# EAGLE design interface boardjbjkb (EAGLE 7.6.0)
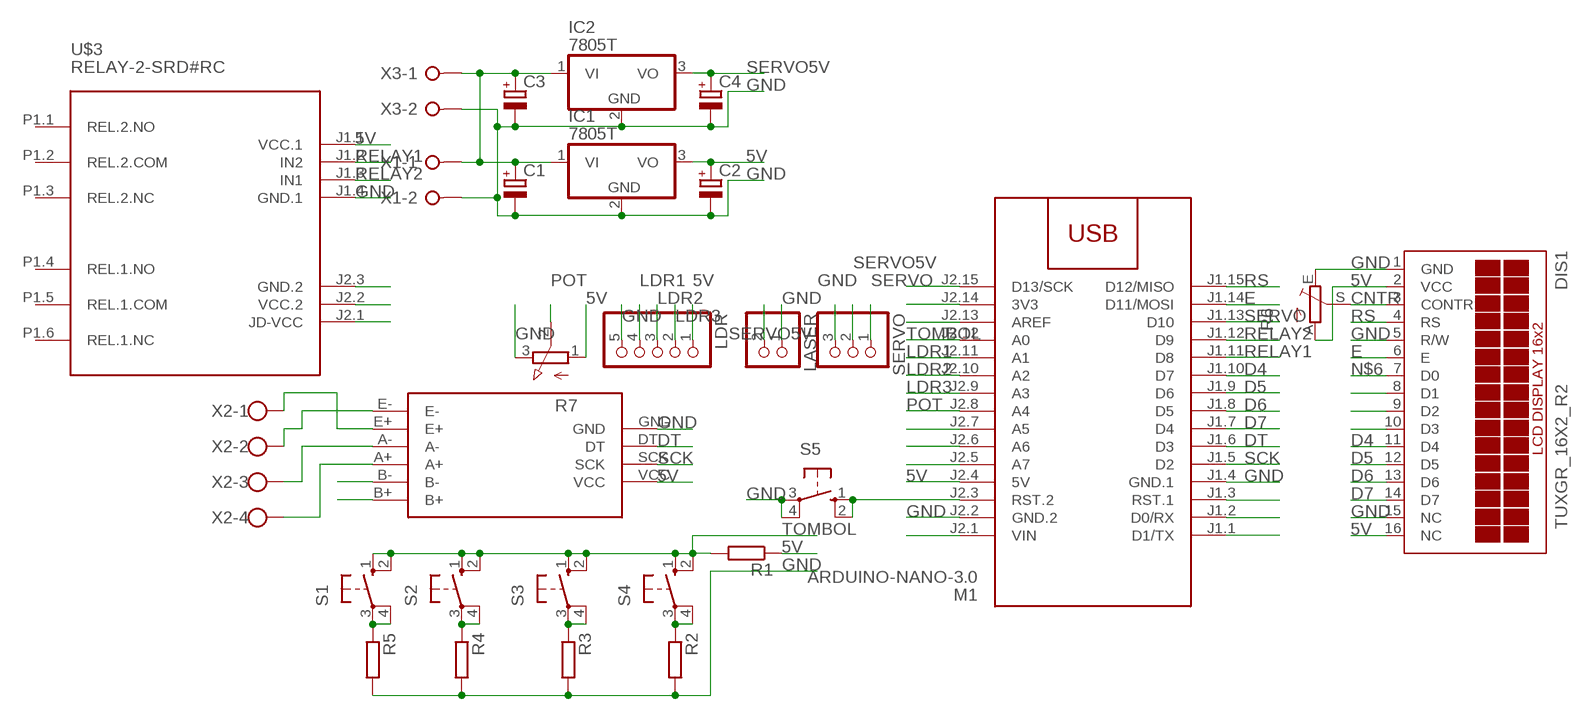
[diagram p0: schematic, sheet 1]

## Parts
C1  CPOL-EUE2.5-7  [E2,5-7]
C2  CPOL-EUE2.5-7  [E2,5-7]
C3  CPOL-EUE2.5-7  [E2,5-7]
C4  CPOL-EUE2.5-7  [E2,5-7]
DIS1  TUXGR_16X2_R2  [TUXGR_16X2_R2]
IC1  7805T  [TO220H]
IC2  7805T  [TO220H]
LASER  PINHD-1X2  [1X02]
LDR  PINHD-1X5  [1X05]
M1  ARDUINO-NANO-3.0  [ARDUINO-NANO-3.0]
R1  R-EU_0207/10  [0207/10]
R2  R-EU_0207/10  [0207/10]
R3  R-EU_0207/10  [0207/10]
R4  R-EU_0207/10  [0207/10]
R5  R-EU_0207/10  [0207/10]
R6  TRIM_EU-B25P  [B25P]
R7  3RP/1610N  [3RP/1610N]
S1  40-XX  [B3F-40XX]
S2  40-XX  [B3F-40XX]
S3  40-XX  [B3F-40XX]
S4  40-XX  [B3F-40XX]
S5  10-XX  [B3F-10XX]
SERVO  PINHD-1X3  [1X03]
U$2  HX711  [HX711]
U$3  RELAY-2-SRD#RC  [RELAY-2-SRD#RC]
X1  W237-02P  [W237-132]
X2  W237-4  [W237-4]
X3  W237-02P  [W237-132]

## Nets
5V: C2.+ DIS1.2(VCC) DIS1.16(NC) IC1.3(VO) LDR.1 M1.J2.4(5V) R1.1 R6.A R7.1(A) U$2.VCC U$3.J1.1(VCC.1)
CNTR: DIS1.3(CONTR) R6.S
D4: DIS1.11(D4) M1.J1.10(D7)
D5: DIS1.12(D5) M1.J1.9(D6)
D6: DIS1.13(D6) M1.J1.8(D5)
D7: DIS1.14(D7) M1.J1.7(D4)
DT: M1.J1.6(D3) U$2.DT
E: DIS1.6(E) M1.J1.14(D11/MOSI)
GND: C1.- C2.- C3.- C4.- DIS1.1(GND) DIS1.5(R/W) DIS1.15(NC) IC1.2(GND) IC2.2(GND) LASER.1 LDR.5 M1.J1.4(GND.1) M1.J2.2(GND.2) R2.2 R3.2 R4.2 R5.2 R6.E R7.3(E) S5.3(P) S5.4(P1) SERVO.3 U$2.GND U$3.J1.4(GND.1) X1.2 X3.2
LDR1: LDR.4 M1.J2.11(A1)
LDR2: LDR.3 M1.J2.10(A2)
LDR3: LDR.2 M1.J2.9(A3)
N$1: C1.+ C3.+ IC1.1(VI) IC2.1(VI) X1.1 X3.1
N$2: U$2.E- X2.2
N$3: U$2.E+ X2.1
N$6: DIS1.7(D0)
N$7: DIS1.8(D1)
N$8: DIS1.9(D2)
N$9: DIS1.10(D3)
N$17: R2.1 S4.3(P) S4.4(P1)
N$18: R3.1 S3.3(P) S3.4(P1)
N$19: R4.1 S2.3(P) S2.4(P1)
N$20: R5.1 S1.3(P) S1.4(P1)
N$22: M1.J2.15(D13/SCK)
N$43: U$2.A- X2.3
N$44: U$2.A+ X2.4
N$45: U$2.B-
N$46: U$2.B+
N$51: M1.J2.14(3V3)
N$52: M1.J2.13(AREF)
N$58: M1.J2.7(A5)
N$59: M1.J2.6(A6)
N$60: M1.J2.5(A7)
N$62: M1.J2.3(RST.2) S5.1(S) S5.2(S1)
N$63: M1.J2.1(VIN)
N$64: M1.J1.1(D1/TX)
N$65: M1.J1.2(D0/RX)
N$66: M1.J1.3(RST.1)
N$78: U$3.J2.2(VCC.2)
N$83: U$3.J2.3(GND.2)
N$84: U$3.J2.1(JD-VCC)
POT: M1.J2.8(A4) R7.2(S)
RELAY1: M1.J1.11(D8) U$3.J1.2(IN2)
RELAY2: M1.J1.12(D9) U$3.J1.3(IN1)
RS: DIS1.4(RS) M1.J1.15(D12/MISO)
SCK: M1.J1.5(D2) U$2.SCK
SERVO: M1.J1.13(D10) SERVO.1
SERVO5V: C4.+ IC2.3(VO) LASER.2 SERVO.2
TOMBOL: M1.J2.12(A0) R1.2 S1.1(S) S1.2(S1) S2.1(S) S2.2(S1) S3.1(S) S3.2(S1) S4.1(S) S4.2(S1)
Unconnected: U$3.P1.1(REL.2.NO) U$3.P1.2(REL.2.COM) U$3.P1.3(REL.2.NC) U$3.P1.4(REL.1.NO) U$3.P1.5(REL.1.COM) U$3.P1.6(REL.1.NC)

## Library data of the parts
C1-C4 = rcl:CPOL-EU: POLARIZED CAPACITOR, European symbol
DIS1 = display-lcd:TUXGR_16X2_R2: Tuxgraphics LCD display 16x2 characters reflective, without background light Source: tuxgr_12x2_r2.pdf; OC_FARNELL: unknown; OC_NEWARK: unknown
IC1 IC2 = linear:78*: Positive VOLTAGE REGULATOR Source: http://cache.national.com/ds/LM/LM78L05.pdf http://www.fairchildsemi.com/ds/LM/LM7805.pdf
LASER = pinhead:PINHD-1X2: PIN HEADER
LDR = pinhead:PINHD-1X5: PIN HEADER
M1 = diy-modules:ARDUINO-NANO-3.0: Arduino Nano 3.0 and compatible devices More details available here: https://www.arduino.cc/en/Main/ArduinoBoardNano Click here to find device on ebay.com <http://www.ebay.com/sch/arduino+nano>
R1-R5 = rcl:R-EU_: RESISTOR, European symbol
R6 = pot:TRIM_EU-: POTENTIOMETER
R7 = pot:3RP/1610N: 16mm Potentiometer one level Source: http://www.alphapotentiometers.net/html/16mm_pot_2.html
S1-S4 = switch-omron:40-XX: OMRON SWITCH; MF: OMRON COMPONENTS USA; MPN: B3F-4000; OC_FARNELL: 176434; OC_NEWARK: 36K3105
S5 = switch-omron:10-XX: OMRON SWITCH; MPN: B3F-1000; OC_FARNELL: 176432; OC_NEWARK: 36M3542
SERVO = pinhead:PINHD-1X3: PIN HEADER
U$2 = HX711:HX711
U$3 = diy-modules:RELAY-2-SRD#RC: 2-Channel Relay Module based on SRD-05VDC-SL-C relays Symbol with relays pins Click here to find device on ebay.com <http://www.ebay.com/sch/two+channel+relay+module+optocoupler+5v>
X1 X3 = con-wago-508:W237-02P: WAGO SREW CLAMP; OC_FARNELL: unknown; OC_NEWARK: unknown
X2 = con-wago-500:W237-4: WAGO SCREW CLAMP; OC_FARNELL: unknown; OC_NEWARK: unknown

## Board
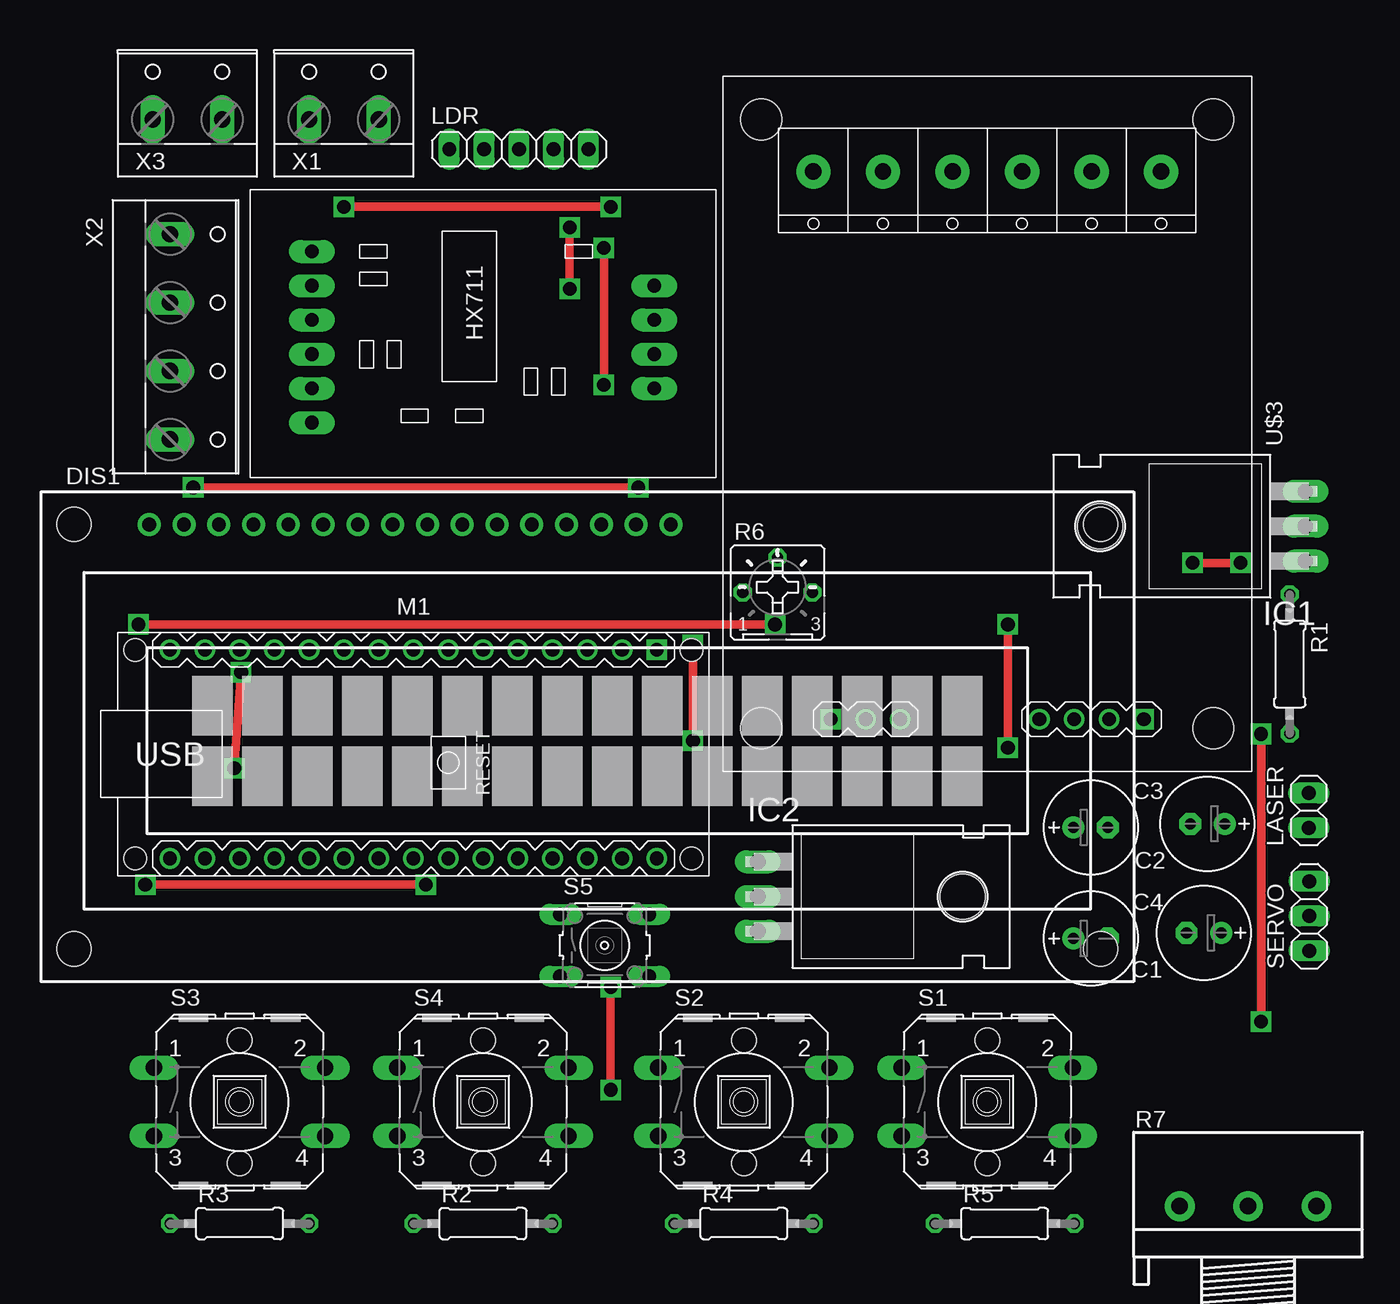
[diagram p1: board, top side]
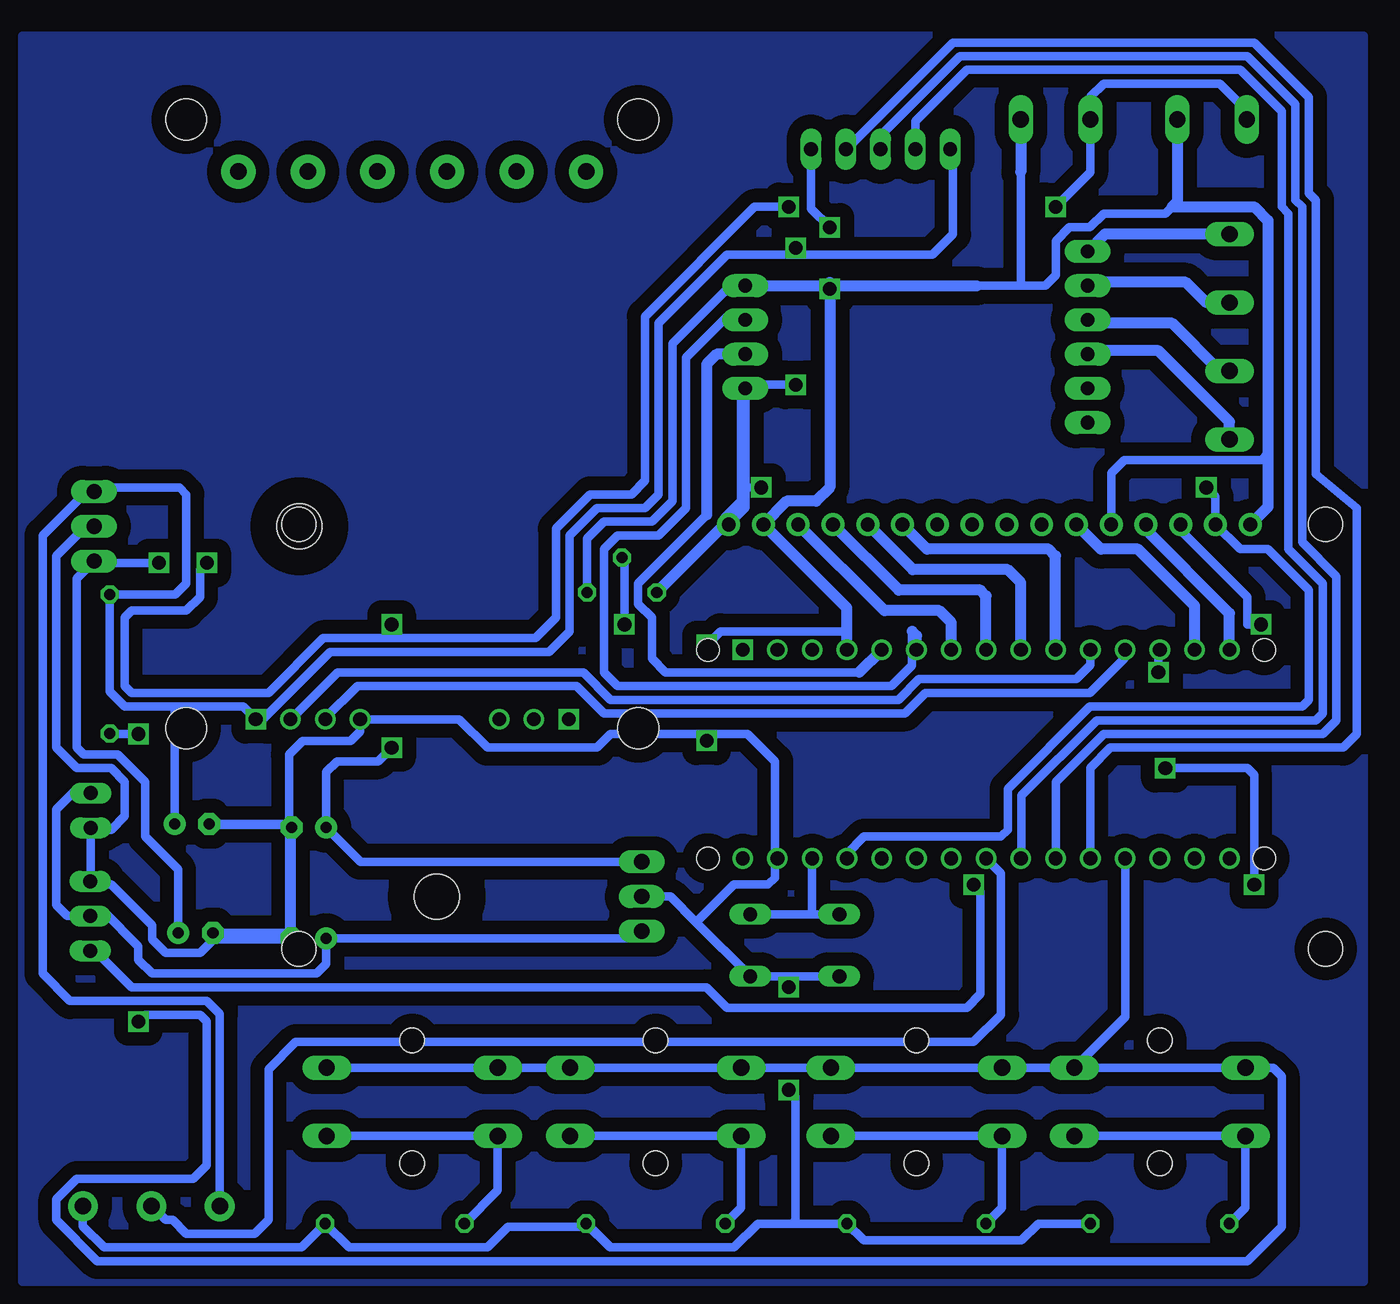
[diagram p2: board, bottom side, seen from below]

No outline drawn. Coordinates in mm, seen from the top.
Copper layers (1*16): Top 0.035mm / dielectric 1.5mm / Bottom 0.035mm
Design rules "default": minimum track width 10mil, minimum drill 24mil, track to track 8mil, track to pad 8mil, pad to pad 8mil, via to via 8mil, smd to smd 8mil, copper to edge 40mil, drill to drill 8mil, minimum pad ring 10mil, minimum via ring 8mil, stop-mask expansion 4mil, vias tented up to drill 0mil, thermal gap 10mil

### Footprints (pad centres in the part's own frame; a part is rotated, then mirrored left to right if it is on the bottom)
E2,5-7 = drill 0.813 pad 1.6: + -1.27,0 | drill 0.813 pad 1.6 octagon: - 1.27,0
TUXGR_16X2_R2 = drill 1 pad 1.676: 1 -32,15.5; 2 -29.46,15.5; 3 -26.92,15.5; 4 -24.38,15.5; 5 -21.84,15.5; 6 -19.3,15.5; 7 -16.76,15.5; 8 -14.22,15.5; 9 -11.68,15.5; 10 -9.14,15.5; 11 -6.6,15.5; 12 -4.06,15.5; 13 -1.52,15.5; 14 1.02,15.5; 15 3.56,15.5; 16 6.1,15.5 | hole 2.5: -37.5,-15.5; 37.5,-15.5; -37.5,15.5; 37.5,15.5
TO220H = drill 1.118 long: 1 -2.54,-10.16; 2 0,-10.16; 3 2.54,-10.16 | hole 3.302: 0,4.826
1X02 = drill 1.016 long: 1 -1.27,0; 2 1.27,0
1X05 = drill 1.016 long: 1 -5.08,0; 2 -2.54,0; 3 0,0; 4 2.54,0; 5 5.08,0
ARDUINO-NANO-3.0 = drill 1 square: J1.1 17.78,7.62 | drill 1: J1.2 15.24,7.62; J1.3 12.7,7.62; J1.4 10.16,7.62; J1.5 7.62,7.62; J1.6 5.08,7.62; J1.7 2.54,7.62; J1.8 0,7.62; J1.9 -2.54,7.62; J1.10 -5.08,7.62; J1.11 -7.62,7.62; J1.12 -10.16,7.62; J1.13 -12.7,7.62; J1.14 -15.24,7.62; J1.15 -17.78,7.62; J2.1 17.78,-7.62; J2.2 15.24,-7.62; J2.3 12.7,-7.62; J2.4 10.16,-7.62; J2.5 7.62,-7.62; J2.6 5.08,-7.62; J2.7 2.54,-7.62; J2.8 0,-7.62; J2.9 -2.54,-7.62; J2.10 -5.08,-7.62; J2.11 -7.62,-7.62; J2.12 -10.16,-7.62; J2.13 -12.7,-7.62; J2.14 -15.24,-7.62; J2.15 -17.78,-7.62 | hole 1.651: -20.32,7.62; -20.32,-7.62; 20.32,-7.62; 20.32,7.62
0207/10 = drill 0.813 octagon: 1 -5.08,0; 2 5.08,0
B25P = drill 0.813 octagon: A -2.54,0; E 2.54,0; S 0,2.54
3RP/1610N = drill 1.2 pad 2.184: 1 -5,0; 2 0,0; 3 5,0
B3F-40XX = drill 1.194 long: 1 -6.248,2.489; 2 6.248,2.489; 3 -6.248,-2.489; 4 6.248,-2.489 | hole 1.803: 0,-4.496; 0,4.496
B3F-10XX = drill 1.016 long: 1 -3.251,2.261; 2 3.251,2.261; 3 -3.251,-2.261; 4 3.251,-2.261
1X03 = drill 1.016 long: 1 -2.54,0; 2 0,0; 3 2.54,0
HX711 = drill 1 pad 1.676 long: A+ -12.5,0; A- -12.5,2.5; B+ -12.5,-5; B- -12.5,-2.5; DT 12.5,2.5; E+ -12.5,7.5; E- -12.5,5; GND 12.5,5; SCK 12.5,0; VCC 12.5,-2.5
RELAY-2-SRD#RC = drill 1 square: J1.1 21.59,11.43; J2.1 21.59,-11.43 | drill 1: J1.2 21.59,8.89; J1.3 21.59,6.35; J1.4 21.59,3.81; J2.2 21.59,-8.89; J2.3 21.59,-6.35 | drill 1.2 pad 2.5: P1.1 -18.415,12.7; P1.2 -18.415,7.62; P1.3 -18.415,2.54; P1.4 -18.415,-2.54; P1.5 -18.415,-7.62; P1.6 -18.415,-12.7 | hole 3: -22.225,16.51; 22.225,16.51; 22.225,-16.51; -22.225,-16.51
W237-132 = drill 1.194 long: 1 -2.54,-0.635; 2 2.54,-0.635
W237-4 = drill 1.194 long: 1 -7.5,-1.27; 2 -2.5,-1.27; 3 2.5,-1.27; 4 7.5,-1.27

### Placement (x,y rotation side)
C1  79.33,36.48 180 top
C2  79.59,44.44 180 top
C3  71.05,44.18 0 top
C4  71.05,36.06 0 top
DIS1  34.29,50.8 0 top
IC1  76.57,66.17 90 top
IC2  56.89,39.13 270 top
LASER  86.98,45.42 90 top
LDR  29.29,93.71 0 top
M1  21.59,49.53 0 top
R1  85.59,56.11 270 top
R2  26.67,15.24 0 top
R3  8.89,15.24 0 top
R4  45.72,15.24 0 top
R5  64.77,15.24 0 top
R6  48.18,61.34 0 top
R7  82.55,16.51 0 top
S1  63.5,24.13 0 top
S2  45.72,24.13 0 top
S3  8.89,24.13 0 top
S4  26.67,24.13 0 top
S5  35.56,35.56 0 top
SERVO  87.02,37.7 90 top
U$2  26.67,78.74 0 top
U$3  63.5,73.66 270 top
X1  16.51,96.52 0 top
X2  5.08,80.01 270 top
X3  5.08,96.52 0 top

### Tracks (layer width: path | path; a pad name or v marks a point on that pad's centre or on a via)
5V  (via drill 1 pad 1.27)
  Top 0.61: v5.5,69 v38,69 | v35.5,76.5 v35.5,86.5
  Bottom 0.61: U$2.VCC 39.17,69 | 39.17,69 39.17,67.52 DIS1.16 | 81,53 84.5,53 85.59,54.09 R1.1 80.81,61.19 80,62 80,68.5 80.5,69 86.44,69 IC1.3 | 81,53 75.86,53 U$3.J1.1 74.43,52.07 69.5,57 53.5,57 52,58.5 52,65.5 50,67.5 46.5,67.5 45.5,68.5 45.5,81 40.5,86 35,86 | C2.+ 80.86,52.86 81,53 | 85.5,68.5 86.52,68.5 IC1.3 | R7.1 77.55,30.55 78.5,31.5 88.5,31.5 90.5,33.5 90.5,65.5 87.5,68.5 86.94,68.5 IC1.3 | v5.5,69 4.83,68.33 DIS1.2 3.03,64.5 1,64.5 -2,61.5 -2,53.5 -1.5,53 14,53 20,47 20,44 20.5,43.5 30.5,43.5 31.75,42.25 M1.J2.4 | v38,69 39.17,69 | 35,86 25.5,86 24,87.5 24,93.5 LDR.1 | 40.68,66.3 40.68,66.82 39.5,68 39.5,76 39,76.5 v35.5,76.5 | v35.5,86.5 35,86
  Bottom 0.813: DIS1.16 40.68,66.3 R6.A
CNTR  (via drill 1 pad 1.27)
  Top 0.61: v1.5,59 v48,59
  Bottom 0.61: DIS1.3 7.37,65.87 2.5,61 2.5,59 v1.5,59 | v48,59 48,63.7 R6.S
D4
  Bottom 0.813: M1.J1.10 16.51,64.01 17,64.5 25.89,64.5 DIS1.11
D5
  Bottom 0.813: M1.J1.9 19.05,62.05 20,63 26.93,63 DIS1.12
D6
  Bottom 0.813: M1.J1.8 21.59,61.09 22,61.5 27.97,61.5 DIS1.13
D7
  Bottom 0.813: M1.J1.7 24.13,59.13 25,60 29.01,60 DIS1.14
DT
  Bottom 0.61: 27,58.5 27,56 28.5,54.5 48.5,54.5 49.5,55.5 49.5,64.5 48.5,65.5 45.5,65.5 43.5,67.5 43.5,78.5 40.5,81.5 39.43,81.5 U$2.DT
  Bottom 0.813: M1.J1.6 26.67,58.17 27,58.5
E
  Bottom 0.813: M1.J1.14 6.35,60.35 10.5,64.5 13.19,64.5 DIS1.6
GND  (via drill 1 pad 1.27)
  Top 0.61: v42,50.5 v42,57.5 | v33,88 v33,83.5 | v36,25 v36,32.5
  Bottom 0.61: S5.3 36,33.3 | 36,33.3 S5.4 42.76,37.24 | R3.2 17.76,15.24 19,14 30.51,14 R2.2 35.76,15.24 | 49,13.5 49.06,13.5 R4.2 | R7.3 87.55,15.05 86,13.5 71.59,13.5 R5.2 68.11,13.5 58,13.5 56.5,15 50.5,15 49,13.5 | 49,13.5 40,13.5 38.26,15.24 35.76,15.24 | IC2.2 44.64,39.13 42.76,37.24 | 41.5,51 49,51 50,50 58,50 60.07,52.07 U$3.J1.4 67.31,51.19 68,50.5 71.5,50.5 72.5,49.5 72.5,44.5 | 37,42.08 37,49 39,51 41.5,51 | 37,42.08 M1.J2.2 | 37,42.08 37,40.5 37.5,40 40,40 42.76,37.24 | 72.5,44.5 72.5,44.36 | 72.5,44.36 C3.- C4.- 72.74,36.48 C1.- | 72.5,44.36 78.24,44.36 C2.- 72.56,44.44 72.5,44.5 | 72.5,44.36 72.5,36 78,36 79,35 81.5,35 82.5,36 82.5,37 85.5,40 86.78,40 SERVO.3 86.98,40.28 LASER.1 86.83,44 85.5,44 84.5,45 84.5,47.5 85.5,48.5 88,48.5 89.5,50 89.5,64 87.33,66.17 IC1.2 | 41.5,51 v42,50.5 | v42,57.5 41,58.5 31.75,58.5 | R6.E 50.72,65.28 49.5,66.5 46,66.5 44.5,68 44.5,79.5 40,84 39.43,84 U$2.GND | DIS1.5 12.45,70.05 11.5,71 1.5,71 1,71.5 | LDR.5 34.37,89.37 v33,88 | v33,83.5 33,84 | 8,89.5 8.5,89 13,89 14,88 15.5,88 16.5,87 16.5,84.5 17.26,83.74 19,83.74 | 22.26,83.74 19,83.74 | 19.05,92.05 19.05,83.79 19,83.74 | 35.76,15.24 35.5,15.5 35.5,24.5 v36,25 | v36,32.5 36,33.3
  Bottom 0.813: 22.26,83.74 U$2.GND 33.26,83.74 33,84 33,69 34,68 36.15,68 DIS1.15 31.75,60.2 31.75,58.5 M1.J1.4 | DIS1.1 1,67.59 1,71.5 1,88.5 2,89.5 8,89.5 7.62,89.88 X3.2 | X1.2 19.05,92.05
LDR1
  Bottom 0.61: LDR.4 31.79,93.71 24,101.5 2,101.5 -2,97.5 -2,90.5 -2.5,90 -2.5,70 -5.5,67.5 -5.5,51 -4.5,50 12.5,50 13.97,48.53 M1.J2.11
LDR2
  Bottom 0.61: LDR.3 29,94 29,95 23.5,100.5 2.5,100.5 -1,97 -1,90 -1.5,89.5 -1.5,65 -4,62.5 -4,52 -3,51 13,51 16.5,47.5 M1.J2.10
LDR3
  Bottom 0.61: LDR.2 26.75,95.75 23,99.5 3,99.5 0,96.5 0,89.5 -0.5,89 -0.5,64.5 -3,62 -3,52.5 -2.5,52 13.5,52 19,46.5 19,41.96 M1.J2.9
N$1  (via drill 1 pad 1.27)
  Top 0.61: v16.5,89.5 v36,89.5 | v78.5,63.5 v82,63.5 | v65,50 v65,59
  Bottom 0.61: IC2.1 67.27,41.67 C3.+ 69.78,48.22 69,49 66,49 v65,50 | C1.+ 80.6,41.1 83,43.5 83,47.5 85,49.5 87.5,49.5 88,50 88,62.36 IC1.1 86.6,63.5 v82,63.5 | v16.5,89.5 13.97,92.03 X1.1 13.97,97.53 13,98.5 4.5,98.5 3,97 3,96 2.5,95.5 2.5,95.84 X3.1 | v36,89.5 38.5,89.5 46.5,81.5 46.5,69.5 47.5,68.5 50.5,68.5 53,66 53,59.5 54.5,58 64.5,58 | 64.5,58 70,58 74,54 84,54 84.5,54.5 84.5,59.5 84,60 80,60 79,61 79,63 v78.5,63.5 | v65,59 65,58.5 64.5,58
N$2
  Bottom 0.813: X2.2 5.51,82.51 7,84 13.91,84 U$2.E-
N$3
  Bottom 0.813: X2.1 12.9,87.51 U$2.E+
N$4
  pour Bottom (isolate 1.016): -6,102 92,102 92,11 -6,11
N$17
  Bottom 0.61: R2.1 20.42,16.41 S4.3 S4.4
N$18
  Bottom 0.61: R3.1 2.64,16.41 S3.3 S3.4
N$19
  Bottom 0.61: R4.1 39.47,16.41 S2.3 S2.4 | S2.4 52.36,21.64 52.5,21.5 52.11,21.5 S2.4
N$20
  Bottom 0.61: R5.1 57.25,17.68 S1.3 S1.4
N$43
  Bottom 0.813: X2.3 4.51,77.51 8,81 13.93,81 U$2.A-
N$44
  Bottom 0.813: X2.4 3.81,73.81 9,79 13.91,79 U$2.A+
N$62
  Bottom 0.61: S5.2 34.5,37.82 | 34.5,37.82 S5.1 | M1.J2.3 34.29,38.03 34.5,37.82
POT
  Bottom 0.61: R7.2 82.51,16.51 81.5,15.5 81,15.5 80,14.5 75,14.5 74,15.5 74,26.5 72,28.5 22.5,28.5 20.5,30.5 20.5,40.82 M1.J2.8
RELAY1
  Bottom 0.61: M1.J1.11 13.97,56.03 15,55 26.5,55 28,53.5 49,53.5 51,55.5 68.96,55.5 U$3.J1.2
RELAY2
  Bottom 0.61: U$3.J1.3 69.85,52.15 67.5,54.5 51.5,54.5 49.5,52.5 27.5,52.5 26,54 14,54 11.5,56.5 11.5,57.08 M1.J1.12
RS
  Bottom 0.813: M1.J1.15 3.81,59.81 10,66 10,66.21 DIS1.4
SCK
  Bottom 0.61: 30.86,55.5 45,55.5 46,56.5 46,59.5 47,60.5 47,62 42,67
  Bottom 0.813: U$2.SCK 41.26,78.74 42,78 42,67 | 30.86,55.5 M1.J1.5
SERVO  (via drill 0.6, 1 pad 1.27)
  Top 0.61: v22.5,40 v2,40 | v8.5,48.5 v9,55.5
  Bottom 0.61: SERVO.1 86.66,35.16 84,32.5 42,32.5 40.5,31 23,31 22,32 22,39.5 v22.5,40 | v2,40 2,48 2.5,48.5 v8.5,48.5 | v9,55.5 9,57.04 M1.J1.13
SERVO5V
  Bottom 0.61: IC2.3 47.26,36.06 C4.+ 69.78,34.22 70.5,33.5 82.5,33.5 83.5,34.5 83.5,35.5 86,38 86.72,38 SERVO.2 88.7,37.7 89.5,38.5 89.5,45.5 88,47 87,47 86.5,46.5 86.79,46.5 LASER.2
TOMBOL  (via drill 1 pad 1.27)
  Top 0.61: v83.5,30 v83.5,51
  Bottom 0.61: M1.J2.12 11.43,30.33 S3.2 | S3.1 S3.2 | S3.2 S4.1 | S4.1 20.88,26.62 21,26.5 20.54,26.5 S4.1 | S4.1 S4.2 S2.1 | S2.1 39.88,26.62 40,26.5 39.59,26.5 S2.1 | S2.1 S2.2 S1.1 S1.2 0.62,26.62 0,26 0,15 2.5,12.5 86.5,12.5 89.5,15.5 89.5,17 88,18.5 79.5,18.5 78.5,19.5 78.5,30 79,30.5 83,30.5 v83.5,30 | v83.5,51 85.56,51 R1.2